# EAGLE design Diseño (I2C) (EAGLE 9.7.0)
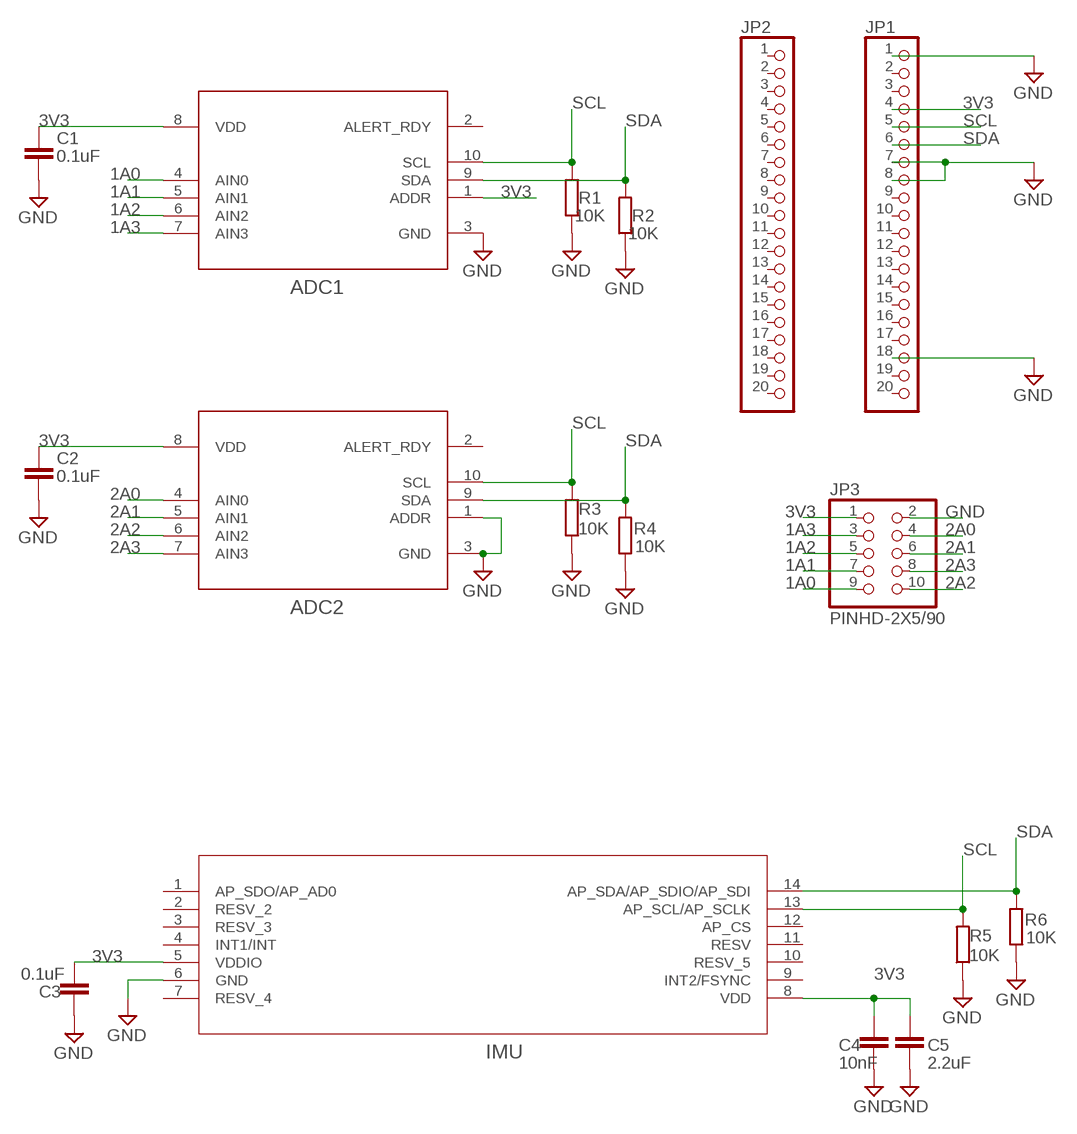
[diagram p0: schematic, sheet 1]

## Parts
ADC1  ADS1015IDGSRDGS0010A_N  [DGS0010A_N]
ADC2  ADS1015IDGSRDGS0010A_N  [DGS0010A_N]
C1  0.1uF  C_CHIP-0603(1608-METRIC)  [CAPC1608X85]
C2  0.1uF  C_CHIP-0603(1608-METRIC)  [CAPC1608X85]
C3  0.1uF  C_CHIP-0603(1608-METRIC)  [CAPC1608X85]
C4  10nF  C_CHIP-0603(1608-METRIC)  [CAPC1608X85]
C5  2.2uF  C_CHIP-0603(1608-METRIC)  [CAPC1608X85]
IMU  ICM-42605LGA14_2P5X3X0P91_IVS-M  [LGA14_2P5X3X0P91_IVS-M]
JP1  PINHD-1X20  [1X20]
JP2  PINHD-1X20  [1X20]
JP3  PINHD-2X5/90  [2X05/90]
R1  10K  R_CHIP-0603(1608-METRIC)  [RESC1608X60]
R2  10K  R_CHIP-0603(1608-METRIC)  [RESC1608X60]
R3  10K  R_CHIP-0603(1608-METRIC)  [RESC1608X60]
R4  10K  R_CHIP-0603(1608-METRIC)  [RESC1608X60]
R5  10K  R_CHIP-0603(1608-METRIC)  [RESC1608X60]
R6  10K  R_CHIP-0603(1608-METRIC)  [RESC1608X60]

## Nets
1A0: ADC1.4(AIN0) JP3.9
1A1: ADC1.5(AIN1) JP3.7
1A2: ADC1.6(AIN2) JP3.5
1A3: ADC1.7(AIN3) JP3.3
2A0: ADC2.4(AIN0) JP3.4
2A1: ADC2.5(AIN1) JP3.6
2A2: ADC2.6(AIN2) JP3.10
2A3: ADC2.7(AIN3) JP3.8
3V3: ADC1.1(ADDR) ADC1.8(VDD) ADC2.8(VDD) C1.1 C2.1 C3.1 C4.1 C5.1 IMU.5(VDDIO) IMU.8(VDD) JP1.4 JP3.1
GND: ADC1.3(GND) ADC2.1(ADDR) ADC2.3(GND) C1.2 C2.2 C3.2 C4.2 C5.2 IMU.6(GND) JP1.1 JP1.7 JP1.8 JP1.18 JP3.2 R1.1 R2.1 R3.1 R4.1 R5.1 R6.1
SCL: ADC1.10(SCL) ADC2.10(SCL) IMU.13(AP_SCL/AP_SCLK) JP1.5 R1.2 R3.2 R5.2
SDA: ADC1.9(SDA) ADC2.9(SDA) IMU.14(AP_SDA/AP_SDIO/AP_SDI) JP1.6 R2.2 R4.2 R6.2
Unconnected: ADC1.2(ALERT_RDY) ADC2.2(ALERT_RDY) IMU.1(AP_SDO/AP_AD0) IMU.2(RESV_2) IMU.3(RESV_3) IMU.4(INT1/INT) IMU.7(RESV_4) IMU.9(INT2/FSYNC) IMU.10(RESV_5) IMU.11(RESV) IMU.12(AP_CS) JP1.2 JP1.3 JP1.9 JP1.10 JP1.11 JP1.12 JP1.13 JP1.14 JP1.15 JP1.16 JP1.17 JP1.19 JP1.20 JP2.1 JP2.2 JP2.3 JP2.4 JP2.5 JP2.6 JP2.7 JP2.8 JP2.9 JP2.10 JP2.11 JP2.12 JP2.13 JP2.14 JP2.15 JP2.16 JP2.17 JP2.18 JP2.19 JP2.20

## Library data of the parts
ADC1 ADC2 = ADS1015:ADS1015IDGSR; COPYRIGHT: Copyright (C) 2024 Ultra Librarian. All rights reserved.; MANUFACTURER_PART_NUMBER: ADS1015IDGSR; MFR_NAME: Texas Instruments; REFDES: RefDes; TYPE: TYPE
C1-C5 = Capacitor:C: Capacitor - Generic; CATEGORY: Capacitor
IMU = ICM42605:ICM-42605; COPYRIGHT: Copyright (C) 2024 Ultra Librarian. All rights reserved.; MANUFACTURER_PART_NUMBER: ICM-42605; MFR_NAME: InvenSense
JP1 JP2 = Connector:PINHD-1X20: PIN HEADER; CATEGORY: Headers; DESCRIPTION: Header, Straight, 10 Position; MANUFACTURER: Generic; MPN: Generic; OPERATING_TEMPERATURE: Generic; PART_STATUS: Active; PITCH: 0.100" (2.54mm); ROHS_COMPLIANCE: Generic; SERIES: Generic; SUB-CATEGORY: Headers, Male Pins; TYPE: Board to Board or Cable, Unshrouded, Through Hole, Straight
JP3 = Connector:PINHD-2X5: PIN HEADER; CATEGORY: Headers; DESCRIPTION: Header, Right Angle, 2x5 Position; MANUFACTURER: Generic; MPN: Generic; OPERATING_TEMPERATURE: Generic; PART_STATUS: Active; PITCH: 0.100" (2.54mm); ROHS_COMPLIANCE: Generic; SERIES: Generic; SUB-CATEGORY: Headers, Male Pins; TYPE: Board to Board or Cable, Unshrouded, Through Hole, Right Angle
R1-R6 = Resistor:R: Resistor Fixed - Generic; CATEGORY: Resistor; SUB-CATEGORY: Fixed

## Board
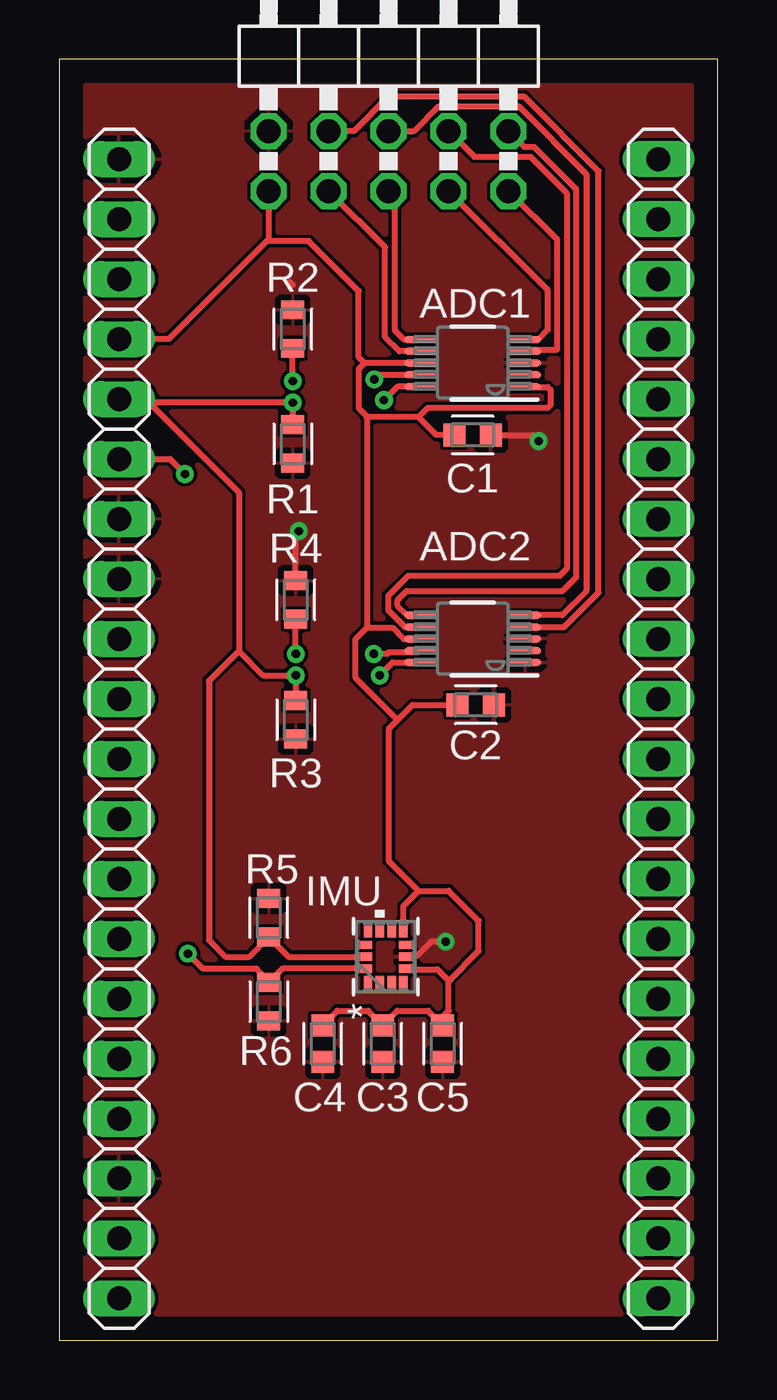
[diagram p1: board, top side]
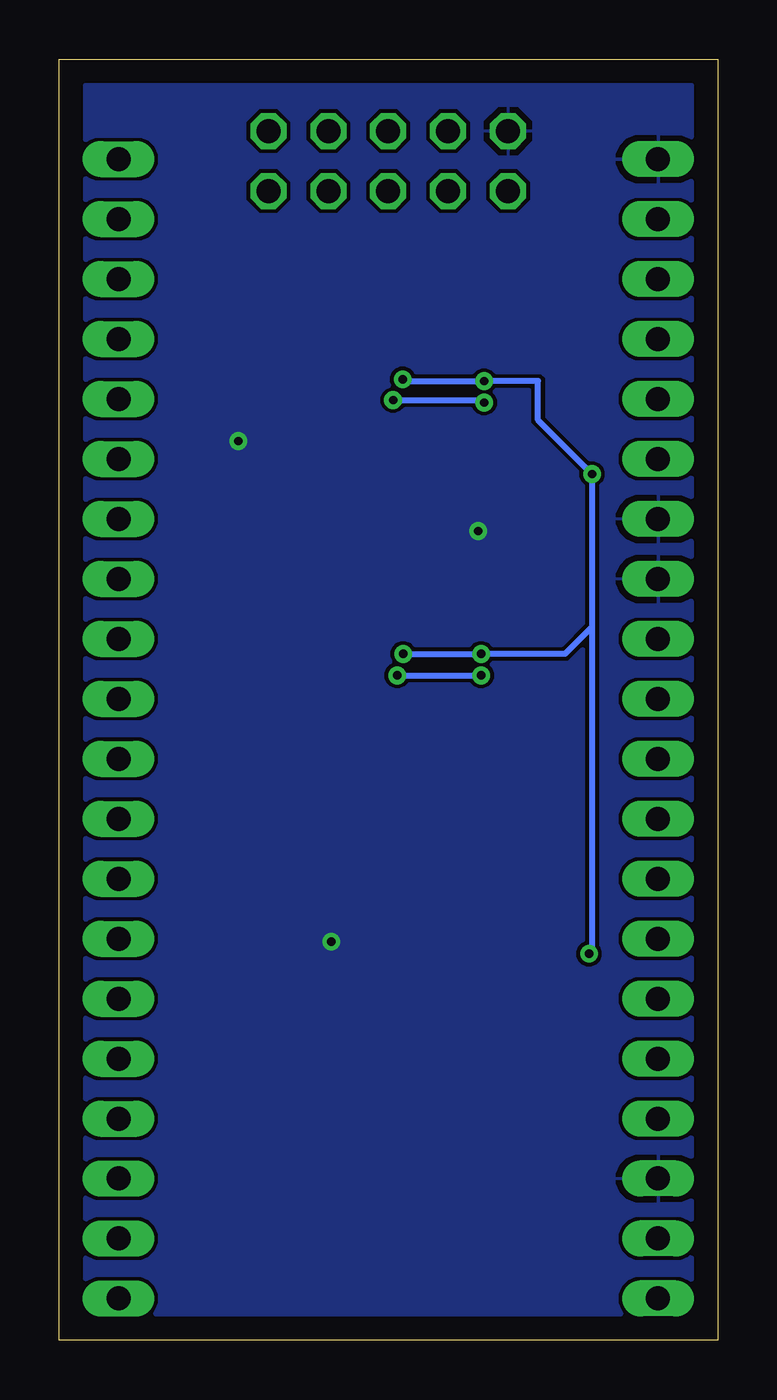
[diagram p2: board, bottom side, seen from below]

Size 27.92 x 54.28 mm. Coordinates in mm from the lower left corner, seen from the top.
Outline: 0,0 27.92,0 27.92,54.28 0,54.28 0,0
Copper layers (1*16): Top / Bottom
Stack-up Default Layer Stack: Top User Defined 0.035mm / Dielectric-1 User Defined 1.5mm / Bottom User Defined 0.035mm
Design rules: minimum copper width 6mil, minimum drill size 0.35mm, copper clearance wire_polygon to wire_polygon 6mil, copper clearance wire_polygon to pad_smd 6mil, copper clearance wire_polygon to via 6mil, copper clearance pad_smd to pad_smd 6mil, copper clearance pad_smd to via 6mil, copper clearance via to via 6mil, copper clearance smd to pad (same net) 6mil, copper clearance smd to via (same net) 6mil, copper clearance smd to smd (same net) 6mil, dimension clearance 40mil, via restrict clearance 0mil, restrict clearance 0mil, drill distance 6mil, keepout clearance 0mil

### Footprints (pad centres in the part's own frame; a part is rotated, then mirrored left to right if it is on the bottom)
DGS0010A_N = smd 1.35 x 0.3: 1 -2.225,1; 2 -2.225,0.5; 3 -2.225,0; 4 -2.225,-0.5; 5 -2.225,-1; 6 2.225,-1; 7 2.225,-0.5; 8 2.225,0; 9 2.225,0.5; 10 2.225,1
CAPC1608X85 = smd 0.921 x 0.97: 1 -0.775,0; 2 0.775,0
LGA14_2P5X3X0P91_IVS-M = smd 0.635 x 0.356: 1 -1.13,0.75; 2 -1.13,0.25; 3 -1.13,-0.25; 4 -1.13,-0.75; 8 1.13,-0.75; 9 1.13,-0.25; 10 1.13,0.25; 11 1.13,0.75 | smd 0.356 x 0.635: 5 -0.5,-0.889; 6 0,-0.889; 7 0.5,-0.889; 12 0.5,0.889; 13 0,0.889; 14 -0.5,0.889
1X20 = drill 1.016 long: 1 -24.13,0; 2 -21.59,0; 3 -19.05,0; 4 -16.51,0; 5 -13.97,0; 6 -11.43,0; 7 -8.89,0; 8 -6.35,0; 9 -3.81,0; 10 -1.27,0; 11 1.27,0; 12 3.81,0; 13 6.35,0; 14 8.89,0; 15 11.43,0; 16 13.97,0; 17 16.51,0; 18 19.05,0; 19 21.59,0; 20 24.13,0
2X05/90 = drill 1.016 octagon: 1 -5.08,-6.35; 2 -5.08,-3.81; 3 -2.54,-6.35; 4 -2.54,-3.81; 5 0,-6.35; 6 0,-3.81; 7 2.54,-6.35; 8 2.54,-3.81; 9 5.08,-6.35; 10 5.08,-3.81
RESC1608X60 = smd 0.799 x 0.974: 1 -0.815,0; 2 0.815,0

### Placement (x,y rotation side)
ADC1  17.53,41.4 180 top
ADC2  17.53,29.72 180 top
C1  17.53,38.35 0 top
C2  17.65,26.92 0 top
C3  13.72,12.57 270 top
C4  11.18,12.57 270 top
C5  16.26,12.57 270 top
IMU  13.84,16.26 90 top
JP1  2.54,25.91 270 top
JP2  25.4,25.91 90 top
JP3  13.97,55.04 0 top
R1  9.91,37.97 90 top
R2  9.91,42.84 270 top
R3  10.03,26.29 90 top
R4  10.03,31.37 270 top
R5  8.89,17.91 270 top
R6  8.89,14.35 90 top

### Tracks (layer width: path | path; a pad name or v marks a point on that pad's centre or on a via)
1A0
  Top 0.254: JP3.9 21.11,46.63 21.11,41.97 19.82,41.97 ADC1.4
1A1
  Top 0.254: JP3.7 20.7,44.5 20.7,42.8 20.3,42.4 ADC1.5
1A2
  Top 0.254: ADC1.6 14.62,42.4 14.22,42.8 14.22,43.18 14.22,43.43 14.22,48.44 JP3.5
1A3
  Top 0.254: JP3.3 13.82,46.3 13.82,42.5 14.42,41.9 ADC1.7
2A0
  Top 0.254: JP3.4 12.5,51.23 13.95,52.68 19.71,52.68 22.86,49.53 22.86,31.69 21.39,30.22 ADC2.4
2A1
  Top 0.254: JP3.6 15.04,51.23 16.08,52.27 19.48,52.27 22.34,49.41 22.34,31.75 21.31,30.72 ADC2.5
2A2
  Top 0.254: JP3.10 19.74,50.55 20.13,50.55 21.92,48.76 21.92,32.33 21.34,31.75 14.73,31.75 14.35,31.37 14.35,31.11 14.75,30.72 ADC2.6
2A3
  Top 0.254: JP3.8 17.6,50.14 19.96,50.14 21.51,48.59 21.51,32.69 21.21,32.38 14.79,32.38 13.95,31.54 13.95,30.94 14.67,30.22 ADC2.7
3V3
  Top 0.254: C4.1 11.8,13.97 13.09,13.97 C3.1 14.34,13.97 15.63,13.97 C5.1 16.26,13.72 16.51,13.97 16.51,15.24 | IMU.5 14.77,15.72 16.03,15.72 16.51,15.24 | IMU.8 14.59,18.4 15.24,19.05 | ADC2.8 14.59,29.72 14.12,30.19 13.04,30.19 | C2.1 14.99,26.92 14.35,26.29 | 15.24,19.05 16.51,19.05 17.78,17.78 17.78,16.51 16.51,15.24 | 14.35,26.29 13.97,25.91 13.97,20.32 15.24,19.05 | ADC1.1 19.77,40.39 20.7,40.39 20.83,40.26 20.83,39.62 20.7,39.5 15.62,39.5 15.24,39.12 | ADC1.8 12.95,41.4 | 12.95,41.4 12.7,41.15 12.7,39.5 13.08,39.12 | 15.24,39.12 13.08,39.12 | C1.1 16,38.35 15.24,39.12 | 14.35,26.29 12.57,28.07 12.57,29.72 13.04,30.19 | JP1.4 4.65,42.42 8.8,46.57 8.89,46.57 | 12.95,41.4 12.7,41.66 12.7,44.45 10.58,46.57 8.89,46.57 | JP3.1 8.89,46.57 | 13.08,39.12 13.04,39.08 13.04,30.19
GND  (via drill 0.35)
  Top 0.254: IMU.6 14.78,16.3 15.16,16.3 15.76,16.89 v16.38,16.89 | C1.2 20.07,38.35 v20.32,38.1 | R3.1 10.16,25.35 | R4.1 10.03,34.16 v10.16,34.29 | 9.91,44.7 9.78,44.83
  pour Top: 0,54.61 27.94,54.61 27.94,0 0,0
  pour Bottom: 0,54.61 27.94,54.61 27.94,0 0,0
SCL  (via drill 0.35)
  Top 0.254: ADC1.10 14.33,40.4 v13.76,39.83 | R1.2 v9.91,39.73 3.81,39.73 | v13.59,28.17 14.13,28.72 ADC2.10 | R3.2 v10.03,28.17 8.66,28.17 7.62,29.21 | 3.81,39.73 2.69,39.73 JP1.5 | 3.81,39.73 7.62,35.92 7.62,29.21 | 7.62,29.21 6.35,27.94 6.35,16.96 7.06,16.26 8.05,16.26 R5.2 9.73,16.26 IMU.13
  Bottom 0.254: v13.76,39.83 10.01,39.83 v9.91,39.73 | v13.59,28.17 v10.03,28.17
SDA  (via drill 0.35)
  Top 0.254: JP1.6 4.7,37.34 v5.33,36.7 | ADC1.9 13.59,40.89 13.41,40.71 v13.36,40.71 | v9.91,40.64 R2.2 | ADC2.9 15.23,29.15 13.97,29.15 13.9,29.08 v13.34,29.08 | v10.03,29.08 R4.2 | IMU.14 9.48,15.76 8.93,15.2 | R6.2 8.93,15.2 | v5.46,16.38 6.1,15.75 8.38,15.75 8.93,15.2
  Bottom 0.254: v13.36,40.71 13.29,40.64 v9.91,40.64 7.62,40.64 7.62,38.99 v5.33,36.7 5.33,30.23 | v13.34,29.08 v10.03,29.08 6.48,29.08 5.33,30.23 | 5.33,30.23 5.33,16.51 v5.46,16.38